# EAGLE schematic ESP32_BLDC_Motor_Driver (EAGLE 9.6.2)
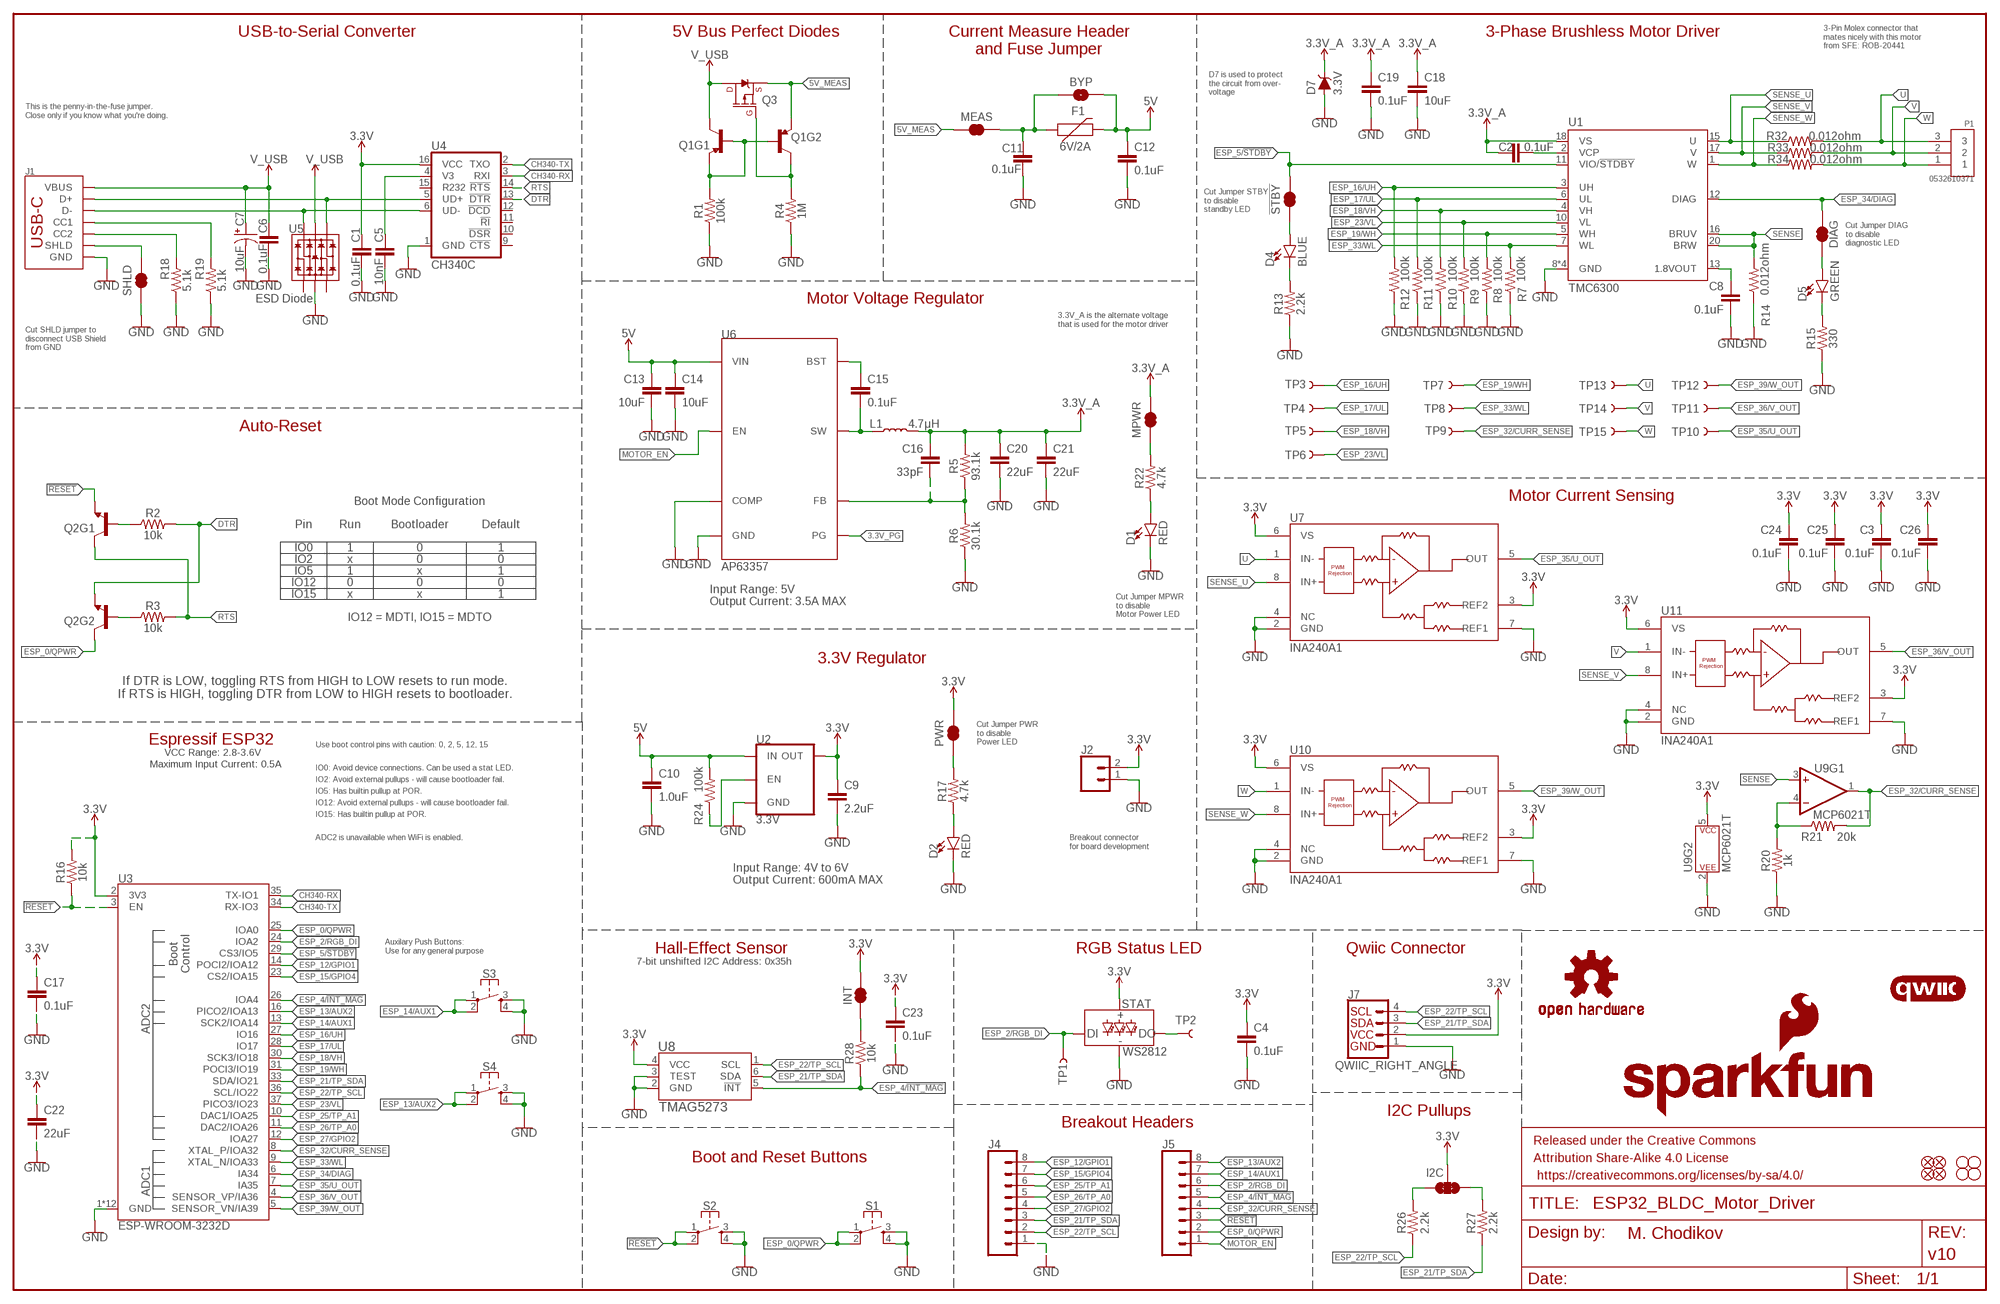
[diagram p0: schematic, sheet 1]

## Parts
!STBY  JUMPER-SMT_2_NC_TRACE_SILK  [SMT-JUMPER_2_NC_TRACE_SILK]
BYP  JUMPER-SMT_2_NO_SILK  [SMT-JUMPER_2_NO_SILK]
C1  0.1uF  0.1UF-0603-25V-10%-X7R-WE  [0603]
C2  0.1uF  0.1UF-0603-25V-10%-X7R-WE  [0603]
C3  0.1uF  0.1UF-0603-25V-5%  [0603]
C4  0.1uF  0.1UF-0603-25V-10%-X7R-WE  [0603]
C5  10nF  10NF-0603-50V-10%  [0603]
C6  0.1uF  0.1UF-0603-25V-(+80/-20%)  [0603]
C7  10uF  10UF-POLAR-0603-6.3V-20%(TANT)  [0603-POLAR]
C8  0.1uF  0.1UF-0603-25V-10%-X7R-WE  [0603]
C9  2.2uF  2.2UF-0603-10V-20%  [0603]
C10  1.0uF  1.0UF-0603-16V-10%-X7R  [0603]
C11  0.1uF  0.1UF-0603-25V-(+80/-20%)  [0603]
C12  0.1uF  0.1UF-0603-25V-(+80/-20%)  [0603]
C13  10uF  10UF-0603-6.3V-20%  [0603]
C14  10uF  10UF-0603-6.3V-20%  [0603]
C15  0.1uF  0.1UF-0603-25V-5%  [0603]
C16  33pF  33PF-0603-50V-5%  [0603]
C17  0.1uF  0.1UF-0603-25V-5%  [0603]
C18  10uF  10UF-0603-6.3V-20%  [0603]
C19  0.1uF  0.1UF-0603-25V-10%-X7R-WE  [0603]
C20  22uF  22UF-0603-6.3V-20%  [0603]
C21  22uF  22UF-0603-6.3V-20%  [0603]
C22  22uF  22UF-0603-6.3V-20%  [0603]
C23  0.1uF  0.1UF-0402-10V-10%-X7R  [0402]
C24  0.1uF  0.1UF-0603-25V-5%  [0603]
C25  0.1uF  0.1UF-0603-25V-5%  [0603]
C26  0.1uF  0.1UF-0603-25V-5%  [0603]
D1  RED  LED-RED_0603-KB  [LED-0603]
D2  RED  LED-RED_0603-KB  [LED-0603]
D4  BLUE  LED-BLUE0603  [LED-0603]
D5  GREEN  LED-GREEN0603  [LED-0603]
D7  3.3V  DIODE-ZENER-MM3Z3V3T1G  [SOD-323]
DIAG  JUMPER-SMT_2_NC_TRACE_SILK  [SMT-JUMPER_2_NC_TRACE_SILK]
F1  6V/2A  PPTC_6V2A  [1210]
FD1  FIDUCIALUFIDUCIAL  [FIDUCIAL-MICRO]
FD2  FIDUCIALUFIDUCIAL  [FIDUCIAL-MICRO]
FD3  FIDUCIALUFIDUCIAL  [FIDUCIAL-MICRO]
FD4  FIDUCIALUFIDUCIAL  [FIDUCIAL-MICRO]
FRAME1  FRAME-LEDGER  [CREATIVE_COMMONS]
H1  STAND-OFF  [STAND-OFF]
H2  STAND-OFF  [STAND-OFF]
H3  STAND-OFF  [STAND-OFF]
H4  STAND-OFF  [STAND-OFF]
I2C  JUMPER-SMT_3_2-NC_TRACE_SILK  [SMT-JUMPER_3_2-NC_TRACE_SILK]
INT  JUMPER-SMT_2_NC_TRACE_SILK  [SMT-JUMPER_2_NC_TRACE_SILK]
J1  USB-C Connector  USB_C_4-LAYER_PADS  [USB-C-16P_4LAYER-PADS]
J2  CONN_021X02_NO_SILK  [1X02_NO_SILK]
J4  Breadboard Connector  CONN_08NO_SILK_DNP  [1X08_NO_SILK]
J5  Breadboard Headers  CONN_08NO_SILK_DNP  [1X08_NO_SILK]
J7  QWIIC_RIGHT_ANGLE  QWIIC_CONNECTORJS-1MM  [JST04_1MM_RA]
L1  4.7μH  4.7μH_SHIELDED_INDUCTORNPIS_LS  [INDUCTOR_4X4MM]
LOGO1  SFE_LOGO_NAMEBLANK  [BLANK]
LOGO2  OSHW-LOGOM  [OSHW-LOGO-M]
LOGO3  SFE_LOGO_FLAME.2_INCH  [SFE_LOGO_FLAME_.2]
LOGO4  QWIIC_LOGO_5MM  [QWIIC_5MM]
MEAS  JUMPER-COMBO_2_NC_TRACE  [COMBO-JUMPER_2_NC_TRACE]
MPWR  JUMPER-SMT_2_NC_TRACE_SILK  [SMT-JUMPER_2_NC_TRACE_SILK]
P1  0532610371  [MOLEX_0532610371]
PWR  JUMPER-SMT_2_NC_TRACE_SILK  [SMT-JUMPER_2_NC_TRACE_SILK]
Q1  TRANS_PNP_DUALSOT-363  [SOT363_PHILIPS]
Q2  NPN Transistors  TRANS_NPN_DUAL-MBT3904DW1T1  [SC70-6]
Q3  20V/4.2A/52mΩ/1.4W  MOSFET_PCH-DMG2305UX-7  [SOT23-3]
R1  100k  100KOHM-0603-1/10W-1%  [0603]
R2  10k  10KOHM-0603-1/10W-1%  [0603]
R3  10k  10KOHM-0603-1/10W-1%  [0603]
R4  1M  1MOHM-0603-1/4W-5%  [0603]
R5  93.1k  93.1KOHM  [0603]
R6  30.1k  30.1KOHM-0603-1/10W-1%  [0603]
R7  100k  100KOHM-0603-1/10W-1%  [0603]
R8  100k  100KOHM-0603-1/10W-1%  [0603]
R9  100k  100KOHM-0603-1/10W-1%  [0603]
R10  100k  100KOHM-0603-1/10W-1%  [0603]
R11  100k  100KOHM-0603-1/10W-1%  [0603]
R12  100k  100KOHM-0603-1/10W-1%  [0603]
R13  2.2k  2.2KOHM-0603-1/10W-1%  [0603]
R14  0.012ohm  0.012OHM0603  [0603]
R15  330  330OHM-0603-1/10W-1%  [0603]
R16  10k  10KOHM-0603-1/10W-1%  [0603]
R17  4.7k  4.7KOHM-0603-1/10W-1%  [0603]
R18  5.1k  5.1KOHM5.1KOHM-0603-1/10W-1%  [0603]
R19  5.1k  5.1KOHM5.1KOHM-0603-1/10W-1%  [0603]
R20  1k  1KOHM-0603-1/10W-1%  [0603]
R21  20k  20KOHM-0603-1/10W-1%  [0603]
R22  4.7k  4.7KOHM-0603-1/10W-1%  [0603]
R24  100k  100KOHM-0603-1/10W-1%  [0603]
R26  2.2k  2.2KOHM-0603-1/10W-1%  [0603]
R27  2.2k  2.2KOHM-0603-1/10W-1%  [0603]
R28  10k  10KOHM-0603-1/10W-1%  [0603]
R32  0.012ohm  0.012OHM0603  [0603]
R33  0.012ohm  0.012OHM0603  [0603]
R34  0.012ohm  0.012OHM0603  [0603]
S1  MOMENTARY-SWITCH-SPST-2-SMD-5.2MM-TALL  [TACTILE_SWITCH_SMD_5.2MM]
S2  MOMENTARY-SWITCH-SPST-2-SMD-5.2MM-TALL  [TACTILE_SWITCH_SMD_5.2MM]
S3  MOMENTARY-SWITCH-SPST-2-SMD-5.2MM-TALL  [TACTILE_SWITCH_SMD_5.2MM]
S4  MOMENTARY-SWITCH-SPST-2-SMD-5.2MM-TALL  [TACTILE_SWITCH_SMD_5.2MM]
SHLD  JUMPER-SMT_2_NC_TRACE_SILK  [SMT-JUMPER_2_NC_TRACE_SILK]
STAT  WS2812_2020  [WS2812-2020]
TP1  TEST-POINT3X4  [PAD.03X.04]
TP2  TEST-POINT3X4  [PAD.03X.04]
TP3  TEST-POINT3X4  [PAD.03X.04]
TP4  TEST-POINT3X4  [PAD.03X.04]
TP5  TEST-POINT3X4  [PAD.03X.04]
TP6  TEST-POINT3X4  [PAD.03X.04]
TP7  TEST-POINT3X4  [PAD.03X.04]
TP8  TEST-POINT3X4  [PAD.03X.04]
TP9  TEST-POINT3X4  [PAD.03X.04]
TP10  TEST-POINT3X4  [PAD.03X.04]
TP11  TEST-POINT3X4  [PAD.03X.04]
TP12  TEST-POINT3X4  [PAD.03X.04]
TP13  TEST-POINT3X4  [PAD.03X.04]
TP14  TEST-POINT3X4  [PAD.03X.04]
TP15  TEST-POINT3X4  [PAD.03X.04]
U1  TMC6300  [QFN-20]
U2  3.3V  V_REG_AP2112K-3.3V  [SOT23-5]
U3  ESP-WROOM-3232D  [ESP-WROOM-32D]
U4  CH340C  [SO016]
U5  ESD Diode  TVS_DIODE_ARRAY_DT1042-04SO-7  [SOT-23-6]
U6  AP63357  [V-DFN3020-13]
U7  INA240A1  INA240A1D  [D8_TEX]
U8  TMAG5273  TMAG5273A1QDBVT  [SOT23-6_DBV_TEX]
U9  MCP6021T  MCP6021T-E/OT  [SOT23-5]
U10  INA240A1  INA240A1D  [D8_TEX]
U11  INA240A1  INA240A1D  [D8_TEX]

## Nets
1.8_VOUT: C8.1 U1.13(1.8VOUT)
3.3V: C1.1 C3.1 C4.1 C9.1 C17.1 C22.1 C23.1 C24.1 C25.1 C26.1 I2C.2 INT.2 J2.2 J7.2 PWR.2 R16.2 STAT.VCC U2.5(OUT) U3.2(3V3) U4.16(VCC) U7.3(REF2) U7.6(VS) U8.4(VCC) U9.5(P$V+) U10.3(REF2) U10.6(VS) U11.3(REF2) U11.6(VS)
3.3V_A: C2.1 C16.2 C18.1 C19.1 C20.1 C21.1 D7.C L1.P$2 MPWR.2 R5.2 U1.18(VS)
3.3V_PG: U6.P$5(PG)
5V: BYP.2 C10.1 C12.1 C13.1 C14.1 F1.2 R24.2 U2.1(IN) U6.P$1(VIN)
5V_MEAS: MEAS.1 MEAS.3 Q1.4(E) Q3.2(S)
!RESET: J5.3 Q2.4(E) R16.1 S2.1 S2.2 U3.3(EN)
BST: C15.1 U6.P$6(BST)
CH340-RX: U3.35(TX-IO1) U4.3(RXI)
CH340-TX: U3.34(RX-IO3) U4.2(TXO)
D: D5.A DIAG.1
D+: J1.A6(D+) J1.B6(D+) U4.5(UD+) U5.4(IO3)
D-: J1.A7(D-) J1.B7(D-) U4.6(UD-) U5.6(IO4)
DTR: Q2.1(E) R2.2 U4.13(!DTR)
ESP_0/QPWR: J5.2 Q2.6(C) S1.1 S1.2 U3.25(IOA0)
ESP_2/RGB_DI: J5.6 STAT.DI TP1.1 U3.24(IOA2)
ESP_4/!INT_MAG: J5.5 R28.1 U3.26(IOA4) U8.5(!INT)
ESP_5/!STDBY: !STBY.2 U1.11(VIO/!STDBY!) U3.29(CS3/IO5)
ESP_12/GPIO1: J4.8 U3.14(POCI2/IOA12)
ESP_13/AUX2: J5.8 S4.1 S4.2 U3.16(PICO2/IOA13)
ESP_14/AUX1: J5.7 S3.1 S3.2 U3.13(SCK2/IOA14)
ESP_15/GPIO4: J4.7 U3.23(CS2/IOA15)
ESP_16/UH: R12.2 TP3.1 U1.3(UH) U3.27(IO16)
ESP_17/UL: R11.2 TP4.1 U1.6(UL) U3.28(IO17)
ESP_18/VH: R10.2 TP5.1 U1.4(VH) U3.30(SCK3/IO18)
ESP_19/WH: R8.2 TP7.1 U1.5(WH) U3.31(POCI3/IO19)
ESP_21/TP_SDA: J4.3 J7.3 R27.1 U3.33(SDA/IO21) U8.6(SDA)
ESP_22/TP_SCL: J4.2 J7.4 R26.1 U3.36(SCL/IO22) U8.1(SCL)
ESP_23/VL: R9.2 TP6.1 U1.10(VL) U3.37(PICO3/IO23)
ESP_25/TP_A1: J4.6 U3.10(DAC1/IOA25)
ESP_26/TP_A0: J4.5 U3.11(DAC2/IOA26)
ESP_27/GPIO2: J4.4 U3.12(IOA27)
ESP_32/CURR_SENSE: J5.4 R21.2 TP9.1 U3.8(XTAL_P/IOA32) U9.1(OUT)
ESP_33/WL: R7.2 TP8.1 U1.7(WL) U3.9(XTAL_N/IOA33)
ESP_34/DIAG: DIAG.2 U1.12(DIAG) U3.6(IA34)
ESP_35/U_OUT: TP10.1 U3.7(IA35) U7.5(OUT)
ESP_36/V_OUT: TP11.1 U3.4(SENSOR_VP/IA36) U11.5(OUT)
ESP_39/W_OUT: TP12.1 U3.5(SENSOR_VN/IA39) U10.5(OUT)
FB: C16.1 R5.1 R6.2 U6.P$3(FB)
GND: C1.2 C3.2 C4.2 C5.2 C6.2 C7.- C8.2 C9.2 C10.2 C11.2 C12.2 C13.2 C14.2 C17.2 C18.2 C19.2 C20.2 C21.2 C22.2 C23.2 C24.2 C25.2 C26.2 D1.C D2.C D7.A J1.GND J1.GND2(GND) J2.1 J4.1 J7.1 R1.1 R4.1 R6.1 R7.1 R8.1 R9.1 R10.1 R11.1 R12.1 R13.1 R14.1 R15.1 R18.1 R19.1 R20.1 S1.3 S1.4 S2.3 S2.4 S3.3 S3.4 S4.3 S4.4 SHLD.1 STAT.GND U1.8(GND) U1.9(GND) U1.14(GND) U1.PAD(GND) U2.2(GND) U3.1(GND) U3.15(GND) U3.38(GND) U3.GND U3.GNDT1(GND) U3.GNDT2(GND) U3.GNDT3(GND) U3.GNDT4(GND) U3.GNDT5(GND) U3.GNDT6(GND) U3.GNDT7(GND) U3.GNDT8(GND) U4.1(GND) U5.2(VSS) U6.P$4(COMP) U6.P$8(GND) U7.2(GND) U7.4(NC) U7.7(REF1) U8.2(GND) U8.3(TEST) U9.2(P$V-) U10.2(GND) U10.4(NC) U10.7(REF1) U11.2(GND) U11.4(NC) U11.7(REF1)
MOTOR_EN: J5.1 U6.P$2(EN)
N$1: J1.A5(CC1) R19.2
N$2: C5.1 U4.4(V3)
N$3: J1.B5(CC2) R18.2
N$4: C2.2 U1.2(VCP)
N$6: R24.1 U2.3(EN)
N$7: Q2.5(B) R2.1
N$8: Q2.2(B) R3.1
N$9: D2.A R17.1
N$11: INT.1 R28.2
N$12: I2C.3 R26.2
N$13: I2C.1 R27.2
N$14: R20.2 R21.1 U9.4(-IN)
N$15: PWR.1 R17.2
N$17: BYP.1 C11.1 F1.1 MEAS.2 MEAS.4
N$21: Q1.3(C) Q3.1(G) R4.2
N$22: Q1.1(E) Q1.2(B) Q1.5(B) R1.2
N$26: D1.A R22.1
N$27: MPWR.1 R22.2
N$29: D4.C R13.2
N$33: D5.C R15.2
RTS: Q2.3(C) R3.2 U4.14(!RTS)
S: !STBY.1 D4.A
SENSE: R14.2 U1.16(BRUV) U1.20(BRW) U9.3(+IN)
SENSE_U: R32.1 U1.15(U) U7.8(IN+)
SENSE_V: R33.1 U1.17(V) U11.8(IN+)
SENSE_W: R34.1 U1.1(W) U10.8(IN+)
SHLD: J1.SHLD1(SHLD) J1.SHLD2(SHLD) J1.SHLD3(SHLD) J1.SHLD4(SHLD) SHLD.2
SW: C15.2 L1.P$1 U6.P$7(SW) U6.P$9(SW)
TP2: STAT.DO TP2.1
U: P1.3 R32.2 TP13.1 U7.1(IN-)
V: P1.2 R33.2 TP14.1 U11.1(IN-)
V_USB: C6.1 C7.+ J1.VBUS1(VBUS) J1.VBUS2(VBUS) Q1.6(C) Q3.3(D) U5.5(VCC)
W: P1.1 R34.2 TP15.1 U10.1(IN-)
Unconnected: U4.9(!CTS) U4.10(!DSR) U4.11(!RI) U4.12(!DCD) U4.15(R232) U5.1(IO1) U5.3(IO2)

## Notes on the sheet
- USB-to-Serial Converter | 5V Bus Perfect Diodes | 3-Phase Brushless Motor Driver
- 3-Pin Molex connector that 
  mates nicely with this motor 
  from SFE: ROB-20441
- Current Measure Header
  and Fuse Jumper
- D7 is used to protect
  the circuit from over-
  voltage
- This is the penny-in-the-fuse jumper.
  Close only if you know what you're doing.
- Cut Jumper STBY
  to disable
  standby LED
- Cut Jumper DIAG
  to disable 
  diagnostic LED
- Motor Voltage Regulator
- 3.3V_A is the alternate voltage 
  that is used for the motor driver
- Cut SHLD jumper to 
  disconnect USB Shield 
  from GND
- Auto-Reset
- Boot Mode Configuration | Motor Current Sensing
- Pin | Run | Bootloader | Default
- IO0 | 1 | 0 | 1
- IO2 | x | 0 | 0
- IO5 | 1 | x | 1
- IO12 | 0 | 0 | 0
- IO15 | x | x | 1
- Input Range: 5V
  Output Current: 3.5A MAX
- IO12 = MDTI, IO15 = MDTO
- Cut Jumper MPWR
  to disable
  Motor Power LED
- 3.3V Regulator
- If DTR is LOW, toggling RTS from HIGH to LOW resets to run mode.
  If RTS is HIGH, toggling DTR from LOW to HIGH resets to bootloader.
- Espressif ESP32 | Use boot control pins with caution: 0, 2, 5, 12, 15
- Cut Jumper PWR
  to disable
  Power LED
- VCC Range: 2.8-3.6V
- Maximum Input Current: 0.5A | IO0: Avoid device connections. Can be used a stat LED.
- IO2: Avoid external pullups - will cause bootloader fail.
- IO5: Has builtin pullup at POR.
- IO12: Avoid external pullups - will cause bootloader fail.
- IO15: Has builtin pullup at POR.
- ADC2 is unavailable when WiFi is enabled.
- Breakout connector
  for board development
- Input Range: 4V to 6V
  Output Current: 600mA MAX
- Auxilary Push Buttons:
  Use for any general purpose
- Hall-Effect Sensor | RGB Status LED | Qwiic Connector
- 7-bit unshifted I2C Address: 0x35h
- WS2812
- I2C Pullups
- Breakout Headers
- Boot and Reset Buttons

## Library data of the parts
!STBY = SparkFun-Jumpers:JUMPER-SMT_2_NC_TRACE: Normally closed trace jumper This jumper has a trace between two pads so it's normally closed (NC). Use a razor knife to open the connection. For best results follow the IPC guidelines for cutting traces: Cutout at least 0.063 mm (0.005 in). Remove all loose material to clean up the cut area. Seal the cut with an approved epoxy. Reapply solder to reclose the connection.; SPICEPREFIX: B
BYP = SparkFun-Jumpers:JUMPER-SMT_2_NO: Normally open jumper This jumper has two pads in close proximity to each other. Apply solder to close the connection. Round pads are easier to solder for beginners, but are a lot larger. SparkFun Product that uses the round pads: SparkFun EL Sequencer <https://www.sparkfun.com/products/12781>
C1 C2 C4 C8 C19 = SparkFun-Capacitors:0.1UF: 0.1µF ceramic capacitors A capacitor is a passive two-terminal electrical component used to store electrical energy temporarily in an electric field.; PROD_ID: CAP-16503
C3 C15 C17 C24-C26 = SparkFun-Capacitors:0.1UF: 0.1µF ceramic capacitors A capacitor is a passive two-terminal electrical component used to store electrical energy temporarily in an electric field.; PROD_ID: CAP-08604
C5 = SparkFun-Capacitors:10NF: 0.01uF/10nF/10,000pF ceramic capacitors A capacitor is a passive two-terminal electrical component used to store electrical energy temporarily in an electric field. CAP-09321; PROD_ID: CAP-00867
C6 C11 C12 = SparkFun-Capacitors:0.1UF: 0.1µF ceramic capacitors A capacitor is a passive two-terminal electrical component used to store electrical energy temporarily in an electric field.; PROD_ID: CAP-00810
C7 = SparkFun-Capacitors:10UF-POLAR: 10.0µF polarized capacitors A capacitor is a passive two-terminal electrical component used to store electrical energy temporarily in an electric field.; PROD_ID: CAP-13210
C9 = SparkFun-Capacitors:2.2UF: 2.2µF ceramic capacitors A capacitor is a passive two-terminal electrical component used to store electrical energy temporarily in an electric field.; PROD_ID: CAP-07888
C10 = SparkFun-Capacitors:1.0UF: 1µF ceramic capacitors A capacitor is a passive two-terminal electrical component used to store electrical energy temporarily in an electric field.; PROD_ID: CAP-13930
C13 C14 C18 = SparkFun-Capacitors:10UF: 10.0µF ceramic capacitors A capacitor is a passive two-terminal electrical component used to store electrical energy temporarily in an electric field.; PROD_ID: CAP-11015
C16 = SparkFun-Capacitors:33PF: 33pF ceramic capacitors A capacitor is a passive two-terminal electrical component used to store electrical energy temporarily in an electric field.; PROD_ID: CAP-10142
C20-C22 = SparkFun-Capacitors:22UF: 22µF ceramic capacitors A capacitor is a passive two-terminal electrical component used to store electrical energy temporarily in an electric field.; PROD_ID: CAP-14464
C23 = SparkFun-Capacitors:0.1UF: 0.1µF ceramic capacitors A capacitor is a passive two-terminal electrical component used to store electrical energy temporarily in an electric field.; PROD_ID: CAP-15083
D1 D2 = SparkFun-LED:LED-RED: Red SMD LED Used in manufacturing of most products at SparkFun Packages: 0603 - KB - KingBright (DIO-17976) SMD 0603 package [Datasheet] <https://www.kingbrightusa.com/images/catalog/SPEC/APT1608SURCK.pdf> 0603 - (DIO-00819, has gone EOL) SMD 0603 package 0603 SMART - SMD 0603 SMART package ( more efficient and expensive)[Product Link] <http://www.osram-os.com/Graphics/XPic2/00077099_0.pdf> 1206 - SMD1206 package [Product Link] <https://www.sparkfun.com/datasheets/DevTools/LilyPad/Q150OVS4.pdff> SparkFun Products: Pro Mini 328 -5V <https://www.sparkfun.com/products/821> RedBoard <https://www.sparkfun.com/products/12757> IOIO-OTG <https://www.sparkfun.com/products/13613>; PROD_ID: DIO-17976
D4 = SparkFun-LED:LED-BLUE: Blue SMD LED Used in manufacturing of various products at SparkFun Packages: 0603 - SMD 0603 package [Product Link] <http://www.digikey.com/product-detail/en/SMLE12BC7TT86/511-1589-2-ND/1641808> 1206 - SMD1206 package [Product Link] <http://www.digikey.com/product-detail/en/lite-on-inc/LTST-C150TBKT/160-1643-1-ND/573584> SparkFun Products: ESP8266 Thing-Dev Board <https://www.sparkfun.com/products/13711> RedBoard <https://www.sparkfun.com/products/12757>; PROD_ID: DIO-08575
D5 = SparkFun-LED:LED-GREEN: Green SMD LED Used in manufacturing of various products at SparkFun Packages: 0603 - SMD 0603 package [Product Link] <http://www.futureelectronics.com/en/technologies/semiconductors/optoelectronics/leds/Pages/9894312-LTST-C190GKT.aspx?CrossPart=HSMG-C190&IM=0> LilyPad 1206 - SMD1206 LilyPad package [Product Link] <http://www.futureelectronics.com/en/Technologies/Product.aspx?ProductID=IN150NGHARVATEKCORPORATION2049943&IM=0> 1206 - SMD1206 package [Product Link] <http://www.futureelectronics.com/en/technologies/semiconductors/optoelectronics/leds/Pages/8315665-LTST-C150KGKT.aspx?IM=0> 1206 Bottom Mount -SMD 1206 Bottom Mount [Product Link] <http://www.digikey.com/product-detail/en/lite-on-inc/LTST-C230KGKT/160-1456-1-ND/386854> SparkFun Products: Pro Mini 328 -5V <https://www.sparkfun.com/products/821> RedBoard <https://www.sparkfun.com/products/12757> MP3 Trigger <https://www.sparkfun.com/products/13720> Makey Makey <https://www.sparkfun.com/products/11076>; PROD_ID: DIO-00821
D7 = SparkFun-DiscreteSemi:DIODE-ZENER: Zener Diode A Zener diode allows current to flow from its anode to its cathode like a normal semiconductor diode, but it also permits current to flow in the reverse direction when its "Zener voltage" is reached. - WIkipedia; PROD_ID: DIO-11284
DIAG INT MPWR PWR SHLD = SparkFun-Jumpers:JUMPER-SMT_2_NC_TRACE: Normally closed trace jumper This jumper has a trace between two pads so it's normally closed (NC). Use a razor knife to open the connection. For best results follow the IPC guidelines for cutting traces: Cutout at least 0.063 mm (0.005 in). Remove all loose material to clean up the cut area. Seal the cut with an approved epoxy. Reapply solder to reclose the connection.
F1 = SparkFun-Fuses:PPTC: Resettable Fuse PPTC Resettable Fuse. Really a sort of resistor with a polymeric positive temperature coefficient whose resistance increases dramatically with an increase in temperature. When heated by the power passing through the resistance rises causing the current to be limited, protecting the circuit. This is achieved by the transition of the polymer from a crystalline to an amorphous state where the conductive carbon separates breaking the conductive pathways found in the cool crystalline structure. When a PPTC cools back down it resumes conducting letting the circuit turn back on. SparkFun Products: SparkFun RedBoard - Programmed with Arduino <https://www.sparkfun.com/products/12757> Pro Micro - 5V/16MHz <https://www.sparkfun.com/products/12640> Arduino Pro 328 - 5V/16MHz <https://www.sparkfun.com/products/10915> MP3 Trigger <https://www.sparkfun.com/products/13720>; PROD_ID: RES-14313
FD1-FD4 = SparkFun-Aesthetics:FIDUCIAL: Fiducial Alignment Points Point-of-reference for pick-and-place machines and other optical instruments.
FRAME1 = SparkFun-Aesthetics:FRAME-LEDGER: Schematic Frame - Ledger Standard 11x14 US Ledger frame; DESIGNER: M. Chodikov; REV: v10
H1-H4 = SparkFun-Hardware:STAND-OFF: Stand Off Drill holes for mechanically mounting via screws, standoffs, etc. Note: Use the keepout ring to avoid running the screw head into surrounding components. Variant Overviews STAND-OFF - Mechanical footprint for a #4 phillips button head screw. STAND-OFF-TIGHT - Mechanical footprint for a #4 phillips button head screw, Example SparkFun Products Screw - Phillips Head (1/4", 4-40, 10 pack) <https://www.sparkfun.com/products/10453> (PRT-10453) Screw - Phillips Head (1/2", 4-40, 10 pack) <https://www.sparkfun.com/products/10452> (PRT-10452) Screw - Phillips Head (3/4", 4-40, 10 pack) <https://www.sparkfun.com/products/10451> (PRT-10451) Screw - Phillips Head (1", 4-40, 10 pack) <https://www.sparkfun.com/products/10450> (PRT-10450)
I2C = SparkFun-Jumpers:JUMPER-SMT_3_2-NC_TRACE: Normally closed trace jumper (2 of 2 connections) This jumper has a trace between all three pads so they are normally closed (NC). Use a razor knife to open the connection(s). For best results follow the IPC guidelines for cutting traces: Cutout at least 0.063 mm (0.005 in). Remove all loose material to clean up the cut area. Seal the cut with an approved epoxy. Reapply solder to reclose the connection(s).
J1 = SparkFun-Connectors:USB_C: USB Type C 16Pin Connector Super Speed pins not available on the 16-pin purely SMD connector so this part is best for USB 2.0 implementations. D1 and D2 are tied together enabling D+/- no matter which way the cable is plugged into the connector. The two channel configuration pins (CC1/2) are exposed. These are normally connected to ground via 5.1k resistors but can be reconfigured for high current/high power applications. **4-LAYER BOARD WARNING!!** If designing 4-layer board, make sure to select the variant _4-LAYER-ISOLATED. The linked footprint (USB-C-16-4LAYER-ISOLATED) includes some very necessary cutout polygons in the inner layers (2 and 15). This prevents the PTH mounting shield legs on the USB connector from electrically connecting any other polygons on the inner layers (usually VCC and GND).; PROD_ID: CONN-14122
J2 = SparkFun-Connectors:CONN_02: Multi connection point. Often used as Generic Header-pin footprint for 0.1 inch spaced/style header connections On any of the 0.1 inch spaced packages, you can populate with these: Break Away Headers - Straight <https://www.sparkfun.com/products/116> (PRT-00116) Break Away Male Headers - Right Angle <https://www.sparkfun.com/products/553> (PRT-00553) Female Headers <https://www.sparkfun.com/products/115> (PRT-00115) Break Away Headers - Machine Pin <https://www.sparkfun.com/products/117> (PRT-00117) Break Away Female Headers - Swiss Machine Pin <https://www.sparkfun.com/products/743> (PRT-00743) For SCREWTERMINALS and SPRING TERMINALS visit here: Screw Terimnals on SparkFun.com <https://www.sparkfun.com/search/results?term=Screw+Terminals> (5mm/3.5mm/2.54mm spacing) This device is also useful as a general connection point to wire up your design to another part of your project. Our various solder wires solder well into these plated through hole pads. Hook-Up Wire - Assortment (Stranded, 22 AWG) <https://www.sparkfun.com/products/11375> (PRT-11375) Hook-Up Wire - Assortment (Solid Core, 22 AWG) <https://www.sparkfun.com/products/11367> (PRT-11367) View the entire wire category on our website here <https://www.sparkfun.com/categories/141> Special notes: Molex polarized connector foot print use with: PRT-08233 with associated crimp pins and housings. 2.54_SCREWTERM for use with PRT-10571. 3.5mm Screw Terminal footprints for PRT-08084 5mm Screw Terminal footprints for use with PRT-08432
J4 J5 = SparkFun-Connectors:CONN_08: Multi connection point. Often used as Generic Header-pin footprint for 0.1 inch spaced/style header connections On any of the 0.1 inch spaced packages, you can populate with these: Break Away Headers - Straight <https://www.sparkfun.com/products/116> (PRT-00116) Break Away Male Headers - Right Angle <https://www.sparkfun.com/products/553> (PRT-00553) Female Headers <https://www.sparkfun.com/products/115> (PRT-00115) Break Away Headers - Machine Pin <https://www.sparkfun.com/products/117> (PRT-00117) Break Away Female Headers - Swiss Machine Pin <https://www.sparkfun.com/products/743> (PRT-00743) Arduino Stackable Header - 8 Pin <https://www.sparkfun.com/products/9279> (PRT-09279) For SCREWTERMINALS and SPRING TERMINALS visit here: Screw Terimnals on SparkFun.com <https://www.sparkfun.com/search/results?term=Screw+Terminals> (5mm/3.5mm/2.54mm spacing) This device is also useful as a general connection point to wire up your design to another part of your project. Our various solder wires solder well into these plated through hole pads. Hook-Up Wire - Assortment (Stranded, 22 AWG) <https://www.sparkfun.com/products/11375> (PRT-11375) Hook-Up Wire - Assortment (Solid Core, 22 AWG) <https://www.sparkfun.com/products/11367> (PRT-11367) View the entire wire category on our website here <https://www.sparkfun.com/categories/141> Special notes: Molex polarized connector foot print use with SKU : PRT-08231 with associated crimp pins and housings. 1MM SMD Version SKU: PRT-10208 NOTES ON THE VARIANTS LOCK and LOCK_LONGPADS... This footprint was designed to help hold the alignment of a through-hole component (i.e. 6-pin header) while soldering it into place. You may notice that each hole has been shifted either up or down by 0.005 of an inch from it's more standard position (which is a perfectly straight line). This slight alteration caused the pins (the squares in the middle) to touch the edges of the holes. Because they are alternating, it causes a "brace" to hold the component in place. 0.005 has proven to be the perfect amount of "off-center" position when using our standard breakaway headers. Although looks a little odd when you look at the bare footprint, once you have a header in there, the alteration is very hard to notice. Also,if you push a header all the way into place, it is covered up entirely on the bottom side.
J7 = SparkFun-Connectors:QWIIC_CONNECTOR: SparkFun I2C Standard Qwiic Connector An SMD 1mm pitch JST connector makes it easy and quick (get it? Qwiic?) to connect I2C devices to each other. The Qwiic system <http://www.sparkfun.com/qwiic> enables fast and solderless connection between popular platforms and various sensors and actuators. We carry 200mm <https://www.sparkfun.com/products/14204>, 100mm <https://www.sparkfun.com/products/14205>, 50mm <https://www.sparkfun.com/products/14206>, and breadboard friendly <https://www.sparkfun.com/products/14207> Qwiic cables. We also offer 10 pcs strips <https://www.sparkfun.com/products/14323> the SMD connectors.; PROD_ID: CONN-13694
L1 = SparkFun-Coils:4.7μH_SHIELDED_INDUCTOR: 4.7uH Inductor 4.7uH 1.4A 50mOhm 1008(2520) Package Shielded; PROD_ID: NDUC-15245
LOGO1 = SparkFun-Aesthetics:SFE_LOGO_NAME: SparkFun Font Logo This is the SparkFun name logo. The logo on the schematic will always be the same size; the package variant is the height of the flame part of the logo (or the height the flame would be, if it were drawn). Default layer for the logo on the board is tSilk.
LOGO2 = SparkFun-Aesthetics:OSHW-LOGO: Open-Source Hardware (OSHW) Logo This logo indicates the piece of hardware it is found on incorporates a OSHW license and/or adheres to the definition of open source hardware found here: http://freedomdefined.org/OSHW
LOGO3 = SparkFun-Aesthetics:SFE_LOGO_FLAME: SparkFun Flame Logo This is the SparkFun flame logo. The logo on the schematic will always be the same size; the package variant is the height of the flame. Default layer for the logo on the board is tSilk.
LOGO4 = SparkFun-Aesthetics:QWIIC_LOGO: Qwiic Logos for placement on schematic and PCB. The 5.5mm silk logo is best for placing next to Qwiic connector.
MEAS = SparkFun-Jumpers:JUMPER-COMBO_2_NC_TRACE
P1 = 0532610371:0532610371: 1.25mm (.049") Pitch PicoBlade Header, Surface Mount, Right Angle, Lead-free, 3 Circuits Check availability <https://pricing.snapeda.com/parts/0532610371/Molex/view-part?ref=eda>; DESCRIPTION: Picoblade Connector, 3 Circuit Single Row, Right Angle Surface Mount SMT PCB; PROD_ID: CONN-16168
Q1 = SparkFun-DiscreteSemi:TRANS_PNP_DUAL: Dual PNP Transistors in Single Package The BCM857BS puts two PNP transistors in a single package. Bipolar (BJT) Transistor Array 2 PNP (Dual) 45V 100mA 100MHz 200mW Surface Mount SOT-363 Datasheet <https://www.diodes.com/assets/Datasheets/BCM857BS.pdf> SparkFun Products: SparkFun Pi Servo HAT V2 <https://www.sparkfun.com>; PROD_ID: TRANS-14386
Q2 = SparkFun-DiscreteSemi:TRANS_NPN_DUAL: Dual NPN Transistors in Single Package The MBT3904W1 puts two general purpose 3904 NPN transistors in a single package. Datasheet <http://www.onsemi.com/pub_link/Collateral/MBT3904DW1T1-D.PDF> SparkFun Products: SparkFun ESP32 Thing <https://www.sparkfun.com/products/13907>; PROD_ID: TRANS-13337
Q3 = SparkFun-DiscreteSemi:MOSFET_PCH: P-channel MOSFETs Voltage controlled devices that allow control of high current outputs. SparkFun Products: SparkFun ESP32 Thing <https://www.sparkfun.com/products/13907> SparkFun ESP8266 Thing <https://www.sparkfun.com/products/13231> SparkFun Pi Servo HAT V2 <https://www.sparkfun.com/products/15316> DMG2305UX-7 (20V/4.2A/SOT23-3); PROD_ID: TRANS-14388
R1 R7-R12 R24 = SparkFun-Resistors:100KOHM: 100kΩ resistor A resistor is a passive two-terminal electrical component that implements electrical resistance as a circuit element. Resistors act to reduce current flow, and, at the same time, act to lower voltage levels within circuits. - Wikipedia; PROD_ID: RES-07828
R2 R3 R16 R28 = SparkFun-Resistors:10KOHM: 10kΩ resistor A resistor is a passive two-terminal electrical component that implements electrical resistance as a circuit element. Resistors act to reduce current flow, and, at the same time, act to lower voltage levels within circuits. - Wikipedia; PROD_ID: RES-00824
R4 = SparkFun-Resistors:1MOHM: 1MΩ resistor A resistor is a passive two-terminal electrical component that implements electrical resistance as a circuit element. Resistors act to reduce current flow, and, at the same time, act to lower voltage levels within circuits. - Wikipedia; PROD_ID: RES-07868
R5 = SparkFun-Resistors:93.1KOHM: 93.1kΩ resistor A resistor is a passive two-terminal electrical component that implements electrical resistance as a circuit element. Resistors act to reduce current flow, and, at the same time, act to lower voltage levels within circuits. - Wikipedia; PROD_ID: RES-14393
R6 = SparkFun-Resistors:30.1KOHM: 30.1kΩ resistor A resistor is a passive two-terminal electrical component that implements electrical resistance as a circuit element. Resistors act to reduce current flow, and, at the same time, act to lower voltage levels within circuits. - Wikipedia; PROD_ID: RES-14690
R13 R26 R27 = SparkFun-Resistors:2.2KOHM: 2.2kΩ resistor A resistor is a passive two-terminal electrical component that implements electrical resistance as a circuit element. Resistors act to reduce current flow, and, at the same time, act to lower voltage levels within circuits. - Wikipedia; PROD_ID: RES-08272
R14 R32-R34 = SparkFun-Resistors:0.012OHM: Generic Resistor Package; PROD_ID: RES-14691
R15 = SparkFun-Resistors:330OHM: 330Ω resistor A resistor is a passive two-terminal electrical component that implements electrical resistance as a circuit element. Resistors act to reduce current flow, and, at the same time, act to lower voltage levels within circuits. - Wikipedia; PROD_ID: RES-00818
R17 R22 = SparkFun-Resistors:4.7KOHM: 4.7kΩ resistor A resistor is a passive two-terminal electrical component that implements electrical resistance as a circuit element. Resistors act to reduce current flow, and, at the same time, act to lower voltage levels within circuits. - Wikipedia; PROD_ID: RES-07857
R18 R19 = SparkFun-Resistors:5.1KOHM; PROD_ID: RES-12083
R20 = SparkFun-Resistors:1KOHM: 1kΩ resistor A resistor is a passive two-terminal electrical component that implements electrical resistance as a circuit element. Resistors act to reduce current flow, and, at the same time, act to lower voltage levels within circuits. - Wikipedia; PROD_ID: RES-07856
R21 = SparkFun-Resistors:20KOHM: 20kΩ resistor A resistor is a passive two-terminal electrical component that implements electrical resistance as a circuit element. Resistors act to reduce current flow, and, at the same time, act to lower voltage levels within circuits. - Wikipedia; PROD_ID: RES-09383
S1-S4 = SparkFun-Switches:MOMENTARY-SWITCH-SPST-2: Momentary Switch (Pushbutton) - SPST - Two Circuits Normally-open (NO) SPST momentary switches (buttons, pushbuttons). Schematic symbol includes two switch circuits. Variants SMD-4.6MMX2.8MM - 4.60mm x 2.80mm Tactile Momentary Button Switch - Used on SparkFun Pro Micro - RP2040 <https://www.sparkfun.com/products/17717> SMD-5.2MM - Mini Pushbutton Switch - SMD <https://www.sparkfun.com/products/8720> - Used on Arduino Pro Mini <https://www.sparkfun.com/products/11114>; PROD_ID: SWCH-14139
STAT = SparkFun-LED:WS2812: Addressable RGB LED - 1 Wire Common names: WS2812, SK6812, Neopixel, APA-106, etc. SMD LED with built-in controller IC. Color: Red/Green/Blue SparkFun Products: LED-SMD RGB (WS2812) <https://www.sparkfun.com/products/11821> LED - RGB Addressable, PTH, 5mm Diffused (5 Pack) <https://www.sparkfun.com/products/12986> LED - RGB Addressable, PTH, 5mm Clear (5 Pack) <https://www.sparkfun.com/products/12999> Blynk Board - ESP8266 <https://www.sparkfun.com/products/13794> Datasheet referenced for footprint: WS2812B-PTH <https://cdn.sparkfun.com/datasheets/Components/LED/COM-12877.pdf>; PROD_ID: DIO-15591
TP1-TP15 = SparkFun-Connectors:TEST-POINT: SparkFun Test Points Bare copper test points for troubleshooting or In-Circuit-Testing. These are used by our Production team for verifying production board runs using pogo-pins on test beds. SparkFun Products: SparkFun LSM9DS1 Breakout <https://www.sparkfun.com/products/13284> SparkFun PSOC <https://www.sparkfun.com/products/13714> SparkFun Load Cell Amplifier <https://www.sparkfun.com/products/13879>
U1 = TMC6300:TMC6300; PROD_ID: IC-17193
U2 = SparkFun-IC-Power:V_REG_AP2112: AP2112 - 600mA CMOS LDO Regulator w/ Enable The AP2112 is CMOS process low dropout linear regulator with enable function, the regulator delivers a guaranteed 600mA (min.) continuous load current. Features Output Voltage Accuracy: ±1.5% Output Current: 600mA (Min.) Foldback Short Current Protection: 50mA Enable Function to Turn ON/OFF VOUT Low Dropout Voltage (3.3V): 250mV (Typ.) @IOUT=600mA Excellent Load Regulation: 0.2%/A (Typ.) Excellent Line Regulation: 0.02%/V (Typ.) Low Quiescent Current: 55μA (Typ.) Low Standby Current: 0.01μA (Typ.) Low Output Noise: 50μVRMS PSRR: 100Hz -65dB, 1kHz -65dB OTSD Protection Stable with 1.0μF Flexible Cap: Ceramic, Tantalum and Aluminum Electrolytic Operation Temperature Range: -40°C to 85°C ESD: MM 400V, HBM 4000V; PROD_ID: VREG-12457
U3 = SparkFun-RF:ESP-WROOM-32: ESP-WROOM-32D - trace antenna (includes keepout) ESP-WROOM-32U - U.FL antenna connector Includes both "standard" footprints and "narrow" version (for use with tighter layouts).; PROD_ID: IC-15676
U4 = SparkFun-IC-Comms:CH340C; PROD_ID: IC-14038
U5 = SparkFun-DiscreteSemi:TVS_DIODE_ARRAY; PROD_ID: IC-13538
U6 = SparkFun-IC-Power:AP63357: The AP63356/AP63357 is a 3.5A, synchronous buck converter with a wide input voltage range of 3.8V to 32V. The device fully integrates a 74mΩ high-side power MOSFET and a 40mΩ low-side power MOSFET to provide high-efficiency step-down DC-DC conversion.; PN: AP63357DV-7; PROD_ID: VREG-17224
U7 U10 U11 = INA240A1:INA240A1D: Bidirectional, Ultra-Precide Current Sense Amplifier Enhanced PWM Rejection, -4V to 80V. Datasheet SparkFun Products SparkFun IoT Brushless Motor Driver (IC-18906); PROD_ID: IC-18906
U8 = TMAG5273:TMAG5273A1QDBVT: Board Mount Hall Effect / Magnetic Sensors This IC is a low-power linear 3D hall-effect sensor with I2C interface. This device integrates three independent Hall-effect sensors in the X, Y, and Z axes. Datasheet <https://www.ti.com/lit/ds/symlink/tmag5273.pdf?HQS=dis-mous-null-mousermode-dsf-pf-null-wwe&ts=1679672375534&ref_url=https%253A%252F%252Fwww.mouser.co.uk%252F>; PROD_ID: ROB-18440
U9 = SparkFun-IC-Amplifiers:MCP6021: MCP6021T-E/OT OP AMP Rail-to-rail input/output op-amp with 10 MHz bandwidth. SparkFun Products ZX Distance and Gesture Sensor <https://www.sparkfun.com/products/12780> (SEN-12780); PROD_ID: IC-12504